# EAGLE design pi_3_hat_V3 (EAGLE 9.4.1)
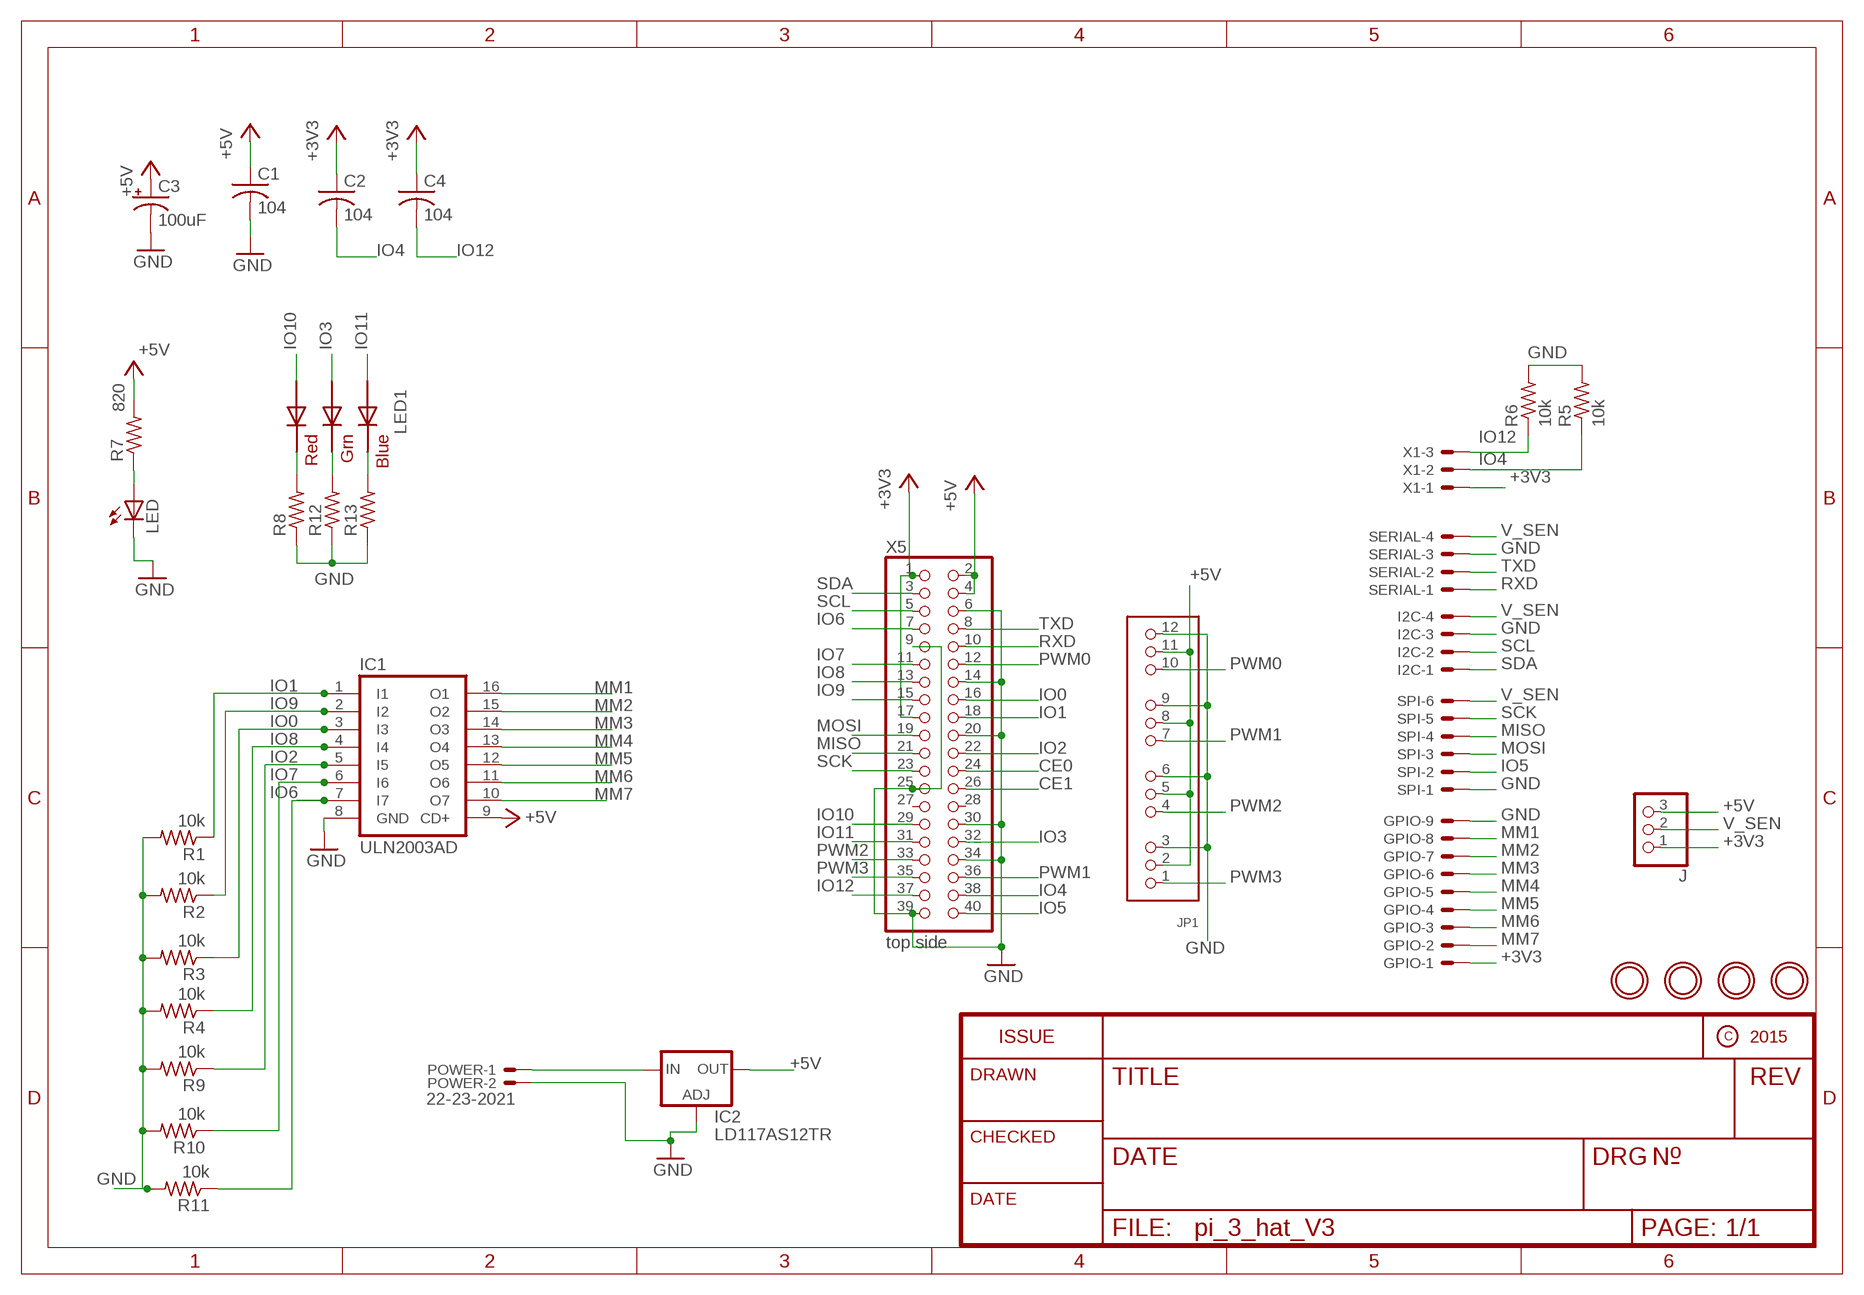
[diagram p0: schematic, sheet 1]

## Parts
C1  104  C-USC1206  [C1206]
C2  104  C-USC1206  [C1206]
C3  100uF  CPOL-USE2.5-6  [E2,5-6]
C4  104  C-USC1206  [C1206]
GPIO  22-23-2091  [22-23-2091]
I2C  22-23-2041  [22-23-2041]
IC1  ULN2003AD  [SO16]
IC2  LD117AS12TR  [SOT223]
J  PINHD-1X3  [1X03]
JP1  HEADER-3X04  [3X04]
LED  LEDSMT1206  [1206]
LED1  RGBLED5050  [RGBLED5050]
POWER  22-23-2021  [22-23-2021]
R1  10k  R-US_R1206  [R1206]
R2  10k  R-US_R1206  [R1206]
R3  10k  R-US_R1206  [R1206]
R4  10k  R-US_R1206  [R1206]
R5  10k  R-US_R1206  [R1206]
R6  10k  R-US_R1206  [R1206]
R7  820  R-US_R1206  [R1206]
R8  R-US_R1206  [R1206]
R9  10k  R-US_R1206  [R1206]
R10  10k  R-US_R1206  [R1206]
R11  10k  R-US_R1206  [R1206]
R12  R-US_R1206  [R1206]
R13  R-US_R1206  [R1206]
SERIAL  22-23-2041  [22-23-2041]
SPI  22-23-2061  [22-23-2061]
U$4  MOUNTINGHOLE2.5  [MOUNTINGHOLE_2.5_PLATED]
U$5  MOUNTINGHOLE2.5  [MOUNTINGHOLE_2.5_PLATED]
U$6  MOUNTINGHOLE2.5  [MOUNTINGHOLE_2.5_PLATED]
U$7  MOUNTINGHOLE2.5  [MOUNTINGHOLE_2.5_PLATED]
X1  22-23-2031  [22-23-2031]
X5  top side  PINHD-2X20  [2X20]

## Nets
+3V3: C2.1 C4.1 GPIO.1 J.1 X1.1 X5.1 X5.17
+5V: C1.1 C3.+ IC1.9(CD+) IC2.4(OUT) J.3 JP1.2 JP1.5 JP1.8 JP1.11 R7.2 X5.2 X5.4
CE0: X5.24
CE1: X5.26
GND: C1.2 C3.- GPIO.9 I2C.3 IC1.8(GND) IC2.1(ADJ) JP1.3 JP1.6 JP1.9 JP1.12 LED.C POWER.2 R1.2 R2.2 R3.2 R4.2 R5.2 R6.2 R8.1 R9.2 R10.2 R11.2 R12.1 R13.1 SERIAL.3 SPI.1 X5.6 X5.9 X5.14 X5.20 X5.25 X5.30 X5.34 X5.39
IO0: IC1.3(I3) R3.1 X5.16
IO1: IC1.1(I1) R1.1 X5.18
IO2: IC1.5(I5) R9.1 X5.22
IO3: LED1.1(GREEN_A) X5.32
IO4: C2.2 R5.1 X1.2 X5.38
IO5: SPI.2 X5.40
IO6: IC1.7(I7) R11.1 X5.7
IO7: IC1.6(I6) R10.1 X5.11
IO8: IC1.4(I4) R4.1 X5.13
IO9: IC1.2(I2) R2.1 X5.15
IO10: LED1.2(RED_A) X5.29
IO11: LED1.3(BLUE_A) X5.31
IO12: C4.2 R6.1 X1.3 X5.37
MISO: SPI.4 X5.21
MM1: GPIO.8 IC1.16(O1)
MM2: GPIO.7 IC1.15(O2)
MM3: GPIO.6 IC1.14(O3)
MM4: GPIO.5 IC1.13(O4)
MM5: GPIO.4 IC1.12(O5)
MM6: GPIO.3 IC1.11(O6)
MM7: GPIO.2 IC1.10(O7)
MOSI: SPI.3 X5.19
N$1: LED.A R7.1
N$3: LED1.5(RED_C) R8.2
N$4: IC2.3(IN) POWER.1
N$5: LED1.6(GREEN_C) R12.2
N$6: LED1.4(BLUE_C) R13.2
PWM0: JP1.10 X5.12
PWM1: JP1.7 X5.36
PWM2: JP1.4 X5.33
PWM3: JP1.1 X5.35
RXD: SERIAL.1 X5.10
SCK: SPI.5 X5.23
SCL: I2C.2 X5.5
SDA: I2C.1 X5.3
TXD: SERIAL.2 X5.8
V_SEN: I2C.4 J.2 SERIAL.4 SPI.6
Unconnected: X5.27 X5.28

## Library data of the parts
C1 C2 C4 = rcl:C-US: CAPACITOR, American symbol; SPICEPREFIX: C
C3 = adafruit:CPOL-US: POLARIZED CAPACITOR, American symbol
GPIO = con-molex:22-23-2091: .100" (2.54mm) Center Header - 9 Pin; MF: MOLEX; MPN: 22-23-2091; OC_FARNELL: 1756827; OC_NEWARK: 56H0450
I2C SERIAL = con-molex:22-23-2041: .100" (2.54mm) Center Header - 4 Pin; MF: MOLEX; MPN: 22-23-2041; OC_FARNELL: 1462920; OC_NEWARK: 38C0355
IC1 = uln-udn:ULN2003A: DRIVER ARRAY
IC2 = v-reg:LD117A?*: Low drop fixed and adjustable positive voltage regulators 1 A Source: http://www.st.com/stonline/products/literature/ds/7194/ld1117axx.pdf
J = pinhead:PINHD-1X3: PIN HEADER
JP1 = microbuilder:HEADER-3X04
LED = adafruit:LED: LED OSRAM: - CHIPLED LG R971, LG N971, LY N971, LG Q971, LY Q971, LO R971, LY R971 LH N974, LH R974 LS Q976, LO Q976, LY Q976 LO Q996 - Hyper CHIPLED LW Q18S LB Q993, LB Q99A, LB R99A - SideLED LS A670, LO A670, LY A670, LG A670, LP A670 LB A673, LV A673, LT A673, LW A673 LH A674 LY A675 LS A676, LA A676, LO A676, LY A676, LW A676 LS A679, LY A679, LG A679 - Hyper Micro SIDELED® LS Y876, LA Y876, LO Y876, LY Y876 LT Y87S - SmartLED LW L88C, LW L88S LB L89C, LB L89S, LG L890 LS L89K, LO L89K, LY L89K LS L896, LA L896, LO L896, LY L896 - TOPLED LS T670, LO T670, LY T670, LG T670, LP T670 LSG T670, LSP T670, LSY T670, LOP T670, LYG T670 LG T671, LOG T671, LSG T671 LB T673, LV T673, LT T673, LW T673 LH T674 LS T676, LA T676, LO T676, LY T676, LB T676, LH T676, LSB T676, LW T676 LB T67C, LV T67C, LT T67C, LS T67K, LO T67K, LY T67K, LW E67C LS E67B, LA E67B, LO E67B, LY E67B, LB E67C, LV E67C, LT E67C LW T67C LS T679, LY T679, LG T679 LS T770, LO T770, LY T770, LG T770, LP T770 LB T773, LV T773, LT T773, LW T773 LH T774 LS E675, LA E675, LY E675, LS T675 LS T776, LA T776, LO T776, LY T776, LB T776 LHGB T686 LT T68C, LB T68C - Hyper Mini TOPLED® LB M676 - Mini TOPLED Santana® LG M470 LS M47K, LO M47K, LY M47K Source: http://www.osram.convergy.de/
LED1 = adafruit:RGBLED: For 5050 RGB LEDs, the order of the LEDs may vary from one manufacturer to another!
POWER = con-molex:22-23-2021: .100" (2.54mm) Center Header - 2 Pin; MF: MOLEX; MPN: 22-23-2021; OC_FARNELL: 1462926; OC_NEWARK: 25C3832
R1-R13 = rcl:R-US_: RESISTOR, American symbol; SPICEPREFIX: R
SPI = con-molex:22-23-2061: .100" (2.54mm) Center Header - 6 Pin; MF: MOLEX; MPN: 22-23-2061; OC_FARNELL: 1462922; OC_NEWARK: 27C1933
U$4-U$7 = microbuilder:MOUNTINGHOLE: Mounting Hole For #2 screws (0.086"/2.18mm width, 0.094"/2.4mm hole) use 2.5mm; BOM: EXCLUDE
X1 = con-molex:22-23-2031: .100" (2.54mm) Center Header - 3 Pin; MF: MOLEX; MPN: 22-23-2031; OC_FARNELL: 1462950; OC_NEWARK: 30C0862
X5 = pinhead:PINHD-2X20: PIN HEADER

## Board
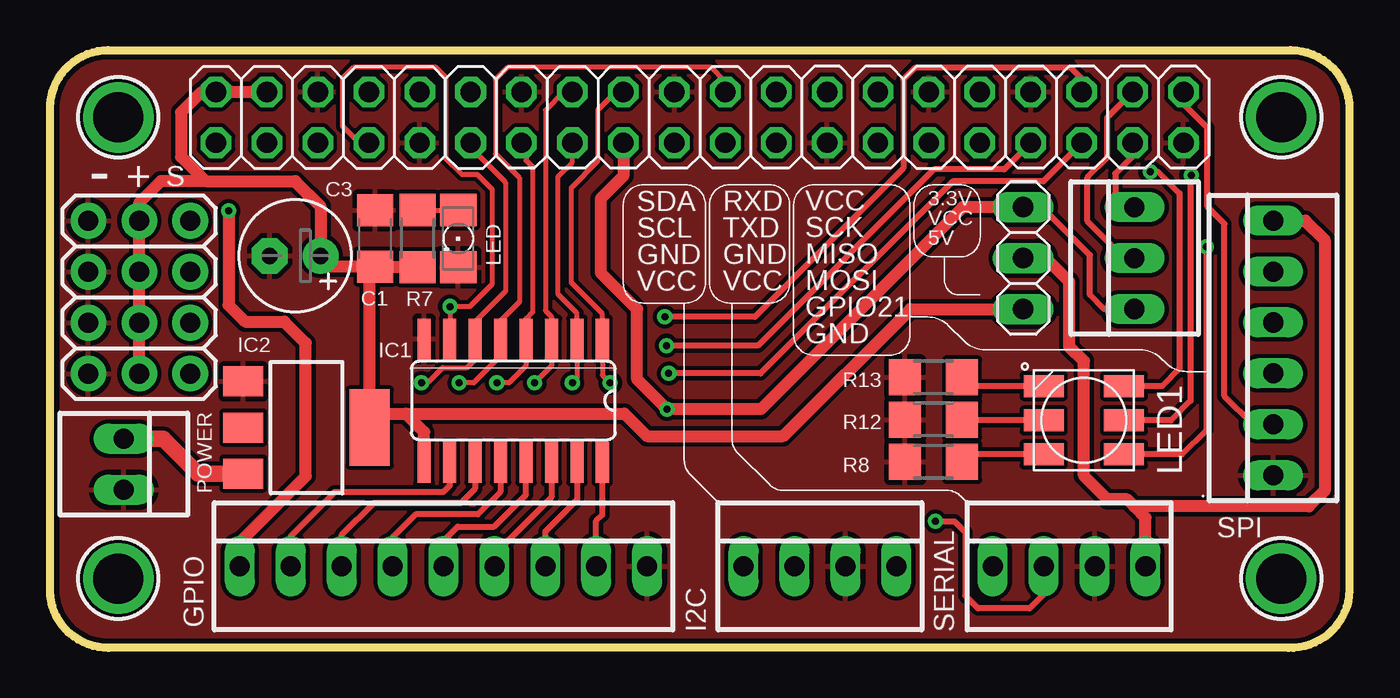
[diagram p1: board, top side]
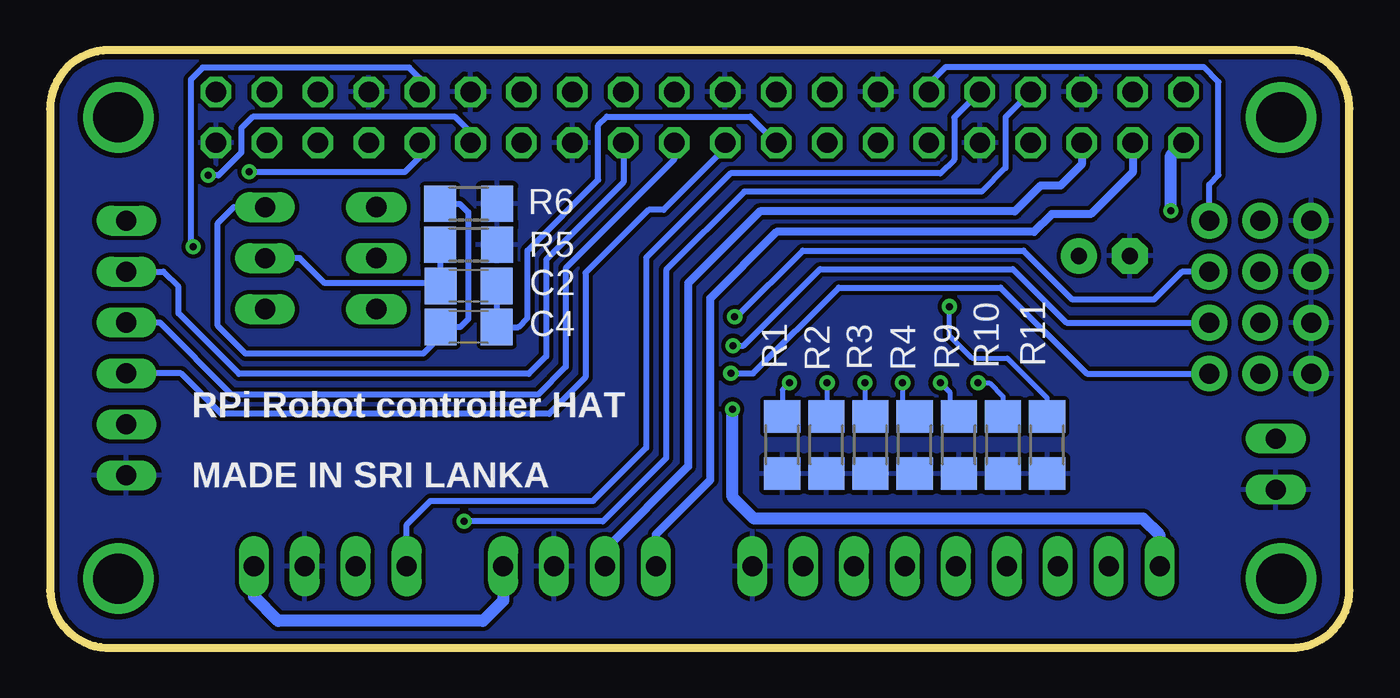
[diagram p2: board, bottom side, seen from below]

Size 64.8 x 29.8 mm. Coordinates in mm from the lower left corner, seen from the top.
Outline: 0,2.87 0,26.89 arc-90 2.9,29.8 61.87,29.8 arc-90 64.8,26.87 64.8,2.86 arc-90 61.75,0 2.92,0 arc-90 0,2.87
Copper layers (1*16): Top 0.035mm / dielectric 1.5mm / Bottom 0.035mm
Design rules "Enclosure-NewZealand V4 *": minimum track width 10mil, minimum drill 10mil, track to track 0.205mm, track to pad 0.205mm, pad to pad 0.205mm, via to via 0.205mm, smd to smd 8mil, copper to edge 10mil, drill to drill 20mil, minimum pad ring 10mil, minimum via ring 8mil, stop-mask expansion 0.0516mm, vias tented up to drill 0mil, thermal gap 10mil

### Footprints (pad centres in the part's own frame; a part is rotated, then mirrored left to right if it is on the bottom)
C1206 = smd 1.6 x 1.8: 1 -1.4,0; 2 1.4,0
E2,5-6 = drill 0.813 pad 1.778: + -1.27,0 | drill 0.813 pad 1.778 octagon: - 1.27,0
22-23-2091 = drill 1 long: 1 -10.16,0; 2 -7.62,0; 3 -5.08,0; 4 -2.54,0; 5 0,0; 6 2.54,0; 7 5.08,0; 8 7.62,0; 9 10.16,0
22-23-2041 = drill 1 long: 1 -3.81,0; 2 -1.27,0; 3 1.27,0; 4 3.81,0
SO16 = smd 0.66 x 2.032: 1 -4.445,-3.073; 2 -3.175,-3.073; 3 -1.905,-3.073; 4 -0.635,-3.073; 5 0.635,-3.073; 6 1.905,-3.073; 7 3.175,-3.073; 8 4.445,-3.073; 9 4.445,3.073; 10 3.175,3.073; 11 1.905,3.073; 12 0.635,3.073; 13 -0.635,3.073; 14 -1.905,3.073; 15 -3.175,3.073; 16 -4.445,3.073
SOT223 = smd 1.5 x 2: 1 -2.3,-3.15; 2 0,-3.15; 3 2.3,-3.15 | smd 3.8 x 2: 4 0,3.15
1X03 = drill 1.016 long: 1 -2.54,0; 2 0,0; 3 2.54,0
3X04 = drill 1 pad 1.778: 1 -3.81,-2.54; 2 -3.81,0; 3 -3.81,2.54; 4 -1.27,-2.54; 5 -1.27,0; 6 -1.27,2.54; 7 1.27,-2.54; 8 1.27,0; 9 1.27,2.54; 10 3.81,-2.54; 11 3.81,0; 12 3.81,2.54
1206 = smd 1.6 x 1.803: A -1.422,0; C 1.422,0
RGBLED5050 = smd 2 x 1.1: 1 -2,1.7; 2 -2,0; 3 -2,-1.7; 4 2,-1.7; 5 2,0; 6 2,1.7
22-23-2021 = drill 1 long: 1 -1.27,0; 2 1.27,0
R1206 = smd 1.6 x 1.803: 1 -1.422,0; 2 1.422,0
22-23-2061 = drill 1 long: 1 -6.35,0; 2 -3.81,0; 3 -1.27,0; 4 1.27,0; 5 3.81,0; 6 6.35,0
MOUNTINGHOLE_2.5_PLATED = drill 2.5 pad 3.2: P$1 0,0
22-23-2031 = drill 1 long: 1 -2.54,0; 2 0,0; 3 2.54,0
2X20 = drill 1.016 octagon: 1 -24.13,-1.27; 2 -24.13,1.27; 3 -21.59,-1.27; 4 -21.59,1.27; 5 -19.05,-1.27; 6 -19.05,1.27; 7 -16.51,-1.27; 8 -16.51,1.27; 9 -13.97,-1.27; 10 -13.97,1.27; 11 -11.43,-1.27; 12 -11.43,1.27; 13 -8.89,-1.27; 14 -8.89,1.27; 15 -6.35,-1.27; 16 -6.35,1.27; 17 -3.81,-1.27; 18 -3.81,1.27; 19 -1.27,-1.27; 20 -1.27,1.27; 21 1.27,-1.27; 22 1.27,1.27; 23 3.81,-1.27; 24 3.81,1.27; 25 6.35,-1.27; 26 6.35,1.27; 27 8.89,-1.27; 28 8.89,1.27; 29 11.43,-1.27; 30 11.43,1.27; 31 13.97,-1.27; 32 13.97,1.27; 33 16.51,-1.27; 34 16.51,1.27; 35 19.05,-1.27; 36 19.05,1.27; 37 21.59,-1.27; 38 21.59,1.27; 39 24.13,-1.27; 40 24.13,1.27

### Placement (x,y rotation side)
C1  16.22,20.41 90 top
C2  43.93,18.04 180 bottom
C3  12.22,19.54 180 top
C4  43.93,16 180 bottom
GPIO  19.62,4.07 0 top
I2C  38.4,4.07 0 top
IC1  23.1,12.33 180 top
IC2  12.79,10.98 270 top
J  48.54,19.43 270 top
JP1  4.45,17.48 90 top
LED  20.36,20.41 270 top
LED1  51.56,11.34 180 top
POWER  3.68,9.16 270 top
R1  28.29,10.11 270 bottom
R2  26.08,10.11 270 bottom
R3  23.88,10.11 270 bottom
R4  21.68,10.11 270 bottom
R5  43.93,20.09 0 bottom
R6  43.93,22.14 0 bottom
R7  18.33,20.41 270 top
R8  44.06,11.38 0 top
R9  19.48,10.11 270 bottom
R10  17.28,10.11 270 bottom
R11  15.07,10.11 270 bottom
R12  44.06,9.27 0 top
R13  44.06,13.48 0 top
SERIAL  50.83,4.07 0 top
SPI  61,14.95 90 top
U$4  61.4,3.45 0 top
U$5  61.4,26.45 0 top
U$6  3.4,26.45 0 top
U$7  3.4,3.45 0 top
X1  54.09,19.43 90 top
X5  32.4,26.45 0 top

### Tracks (layer width: path | path; a pad name or v marks a point on that pad's centre or on a via)
+3V3  (via drill 0.35)
  Top 0.305: X1.1 52.56,16.89 51.86,17.6 51.86,19.58 49.47,21.97 J.1
  Top 0.61: X5.17 28.59,23.53 27.45,22.39 27.45,18.71 29.27,16.88 29.27,13.39 v30.77,11.9 35.45,11.9 45.52,21.97 J.1 | v8.9,21.79 8.9,17.09 9.73,16.26 11.68,16.26 12.75,15.19 12.75,8.56 9.46,5.26 GPIO.1
  Bottom 0.305: X5.17 29.89,26.48 37.03,26.48 37.46,26.05 37.46,23.33 40.99,19.8 40.99,16.45 41.45,16 C4.1 C2.1
  Bottom 0.61: v8.9,21.79 8.9,24.55 X5.1 | GPIO.1 9.46,5.61 10.3,6.44 29.69,6.44 30.77,7.52 v30.77,11.9
+5V
  Top 0.61: 15.94,11.77 IC2.4 | X5.4 X5.2 7.57,27.72 6.53,26.69 6.53,24.48 7.75,23.27 | 7.75,23.27 | 7.75,23.27 12.23,23.27 13.49,22.01 C3.+ 14.03,19.01 C1.1 16.24,18.99 | JP1.2 JP1.5 JP1.8 JP1.11 4.45,22.19 5.53,23.27 7.75,23.27 | 17.73,11.68 16.03,11.68 15.94,11.77 | IC1.9 18.65,10.76 17.73,11.68 | R7.2 16.24,18.99 | 16.24,18.99 15.94,18.68 15.94,11.77 | 17.73,11.68 28.64,11.68 29.76,10.56 36.56,10.56 42.9,16.89 J.3
GND
  pour Top: 66.45,-1.34 66.45,2.65 66.45,31.34 -0.68,31.34 -0.68,-1.34 -0.66,-1.34 -0.66,-1.33
  pour Bottom: -0.76,-1.49 66.64,-1.49 66.64,31.49 -0.76,31.49
IO0  (via drill 0.35)
  Top 0.254: X5.16 25.61,27.72 24.7,26.81 24.7,16.82 25,16.51 IC1.3 25,14.05 v24.17,13.21
  Bottom 0.254: v24.17,13.21 24.17,11.82 R3.1
IO1  (via drill 0.35)
  Top 0.254: X5.18 28.23,27.72 27.31,26.8 27.31,24.26 26,22.95 26,18.2 27.54,16.65 IC1.1 27.54,13.6 v27.93,13.21
  Bottom 0.254: v27.93,13.21 28.29,12.86 R1.1
IO2  (via drill 0.35)
  Top 0.254: X5.22 33.67,28.26 32.98,28.94 22.82,28.94 22.22,28.34 22.22,24.63 23.41,23.43 23.41,17.25 22.46,16.31 IC1.5 22.46,14.56 21.12,13.21 v20.4,13.21
  Bottom 0.254: v20.4,13.21 19.93,12.75 19.93,11.89 19.57,11.53 R9.1
IO3  (via drill 0.35)
  Top 0.305: v57.66,20 57.66,10.86 56.45,9.64 LED1.1
  Bottom 0.305: X5.32 46.37,28.4 46.89,28.92 57.2,28.92 57.79,28.33 57.79,20.12 v57.66,20
IO4
  Top 0.305: X1.2 53.58,19.43 51.74,21.27 51.74,23.46 52.72,24.44 52.72,26.45 X5.38
  Bottom 0.305: R5.1 45.35,18.06 C2.2 45.48,18.19 51.1,18.19 52.34,19.43 X1.2
IO5
  Top 0.305: SPI.2 59.98,11.14 58.57,12.55 58.57,21.14 57.72,22 57.72,25.94 56.53,27.12 X5.40
IO6  (via drill 0.35)
  Top 0.254: IC1.7 19.94,15.42 v19.94,17.02 20.93,17.02 22.03,18.12 22.03,22.87 21.3,23.6 20.54,23.6 19.72,24.42 19.72,28.46 19.21,28.97 15.16,28.97 14.59,28.39 14.59,26.01 15.41,25.18 X5.7
  Bottom 0.254: R11.1 15.07,12.45 17.06,14.44 18.82,14.44 19.94,15.56 v19.94,17.02
IO7  (via drill 0.35)
  Top 0.254: v18.52,13.21 18.83,13.21 19.58,13.97 20.81,13.97 21.19,14.36 IC1.6 21.19,16.25 21.33,16.39 22.71,17.77 22.71,23.21 20.97,24.95 X5.11
  Bottom 0.254: v18.52,13.21 17.96,13.21 17.28,12.53 R10.1
IO8  (via drill 0.35)
  Top 0.254: v22.28,13.21 22.88,13.21 23.73,14.06 IC1.4 23.73,16.42 24.07,16.75 24.07,23.98 23.73,24.31 23.73,24.96 X5.13
  Bottom 0.254: v22.28,13.21 22.28,12.14 R4.1
IO9  (via drill 0.35)
  Top 0.254: v26.05,13.21 26.27,13.44 IC1.2 26.27,16.69 25.34,17.62 25.34,23.51 26.05,24.22 X5.15
  Bottom 0.254: v26.05,13.21 26.05,11.57 R2.1
IO10  (via drill 0.35)
  Top 0.305: LED1.2 55.91,11.34 56.87,12.31 56.87,23.52 v56.91,23.56
  Bottom 0.305: X5.29 43.83,25.71 44.6,26.47 54.7,26.47 55.26,25.91 55.26,24.7 56.4,23.56 v56.91,23.56
IO11  (via drill 0.35)
  Top 0.305: LED1.3 55.47,13.04 56.33,13.91 56.33,22.67 55.27,23.74 v54.87,23.74
  Bottom 0.305: X5.31 46.37,24.47 47.1,23.74 v54.87,23.74
IO12
  Top 0.305: X5.37 53.99,24.5 53.13,23.64 53.13,22.65 53.8,21.97 X1.3
  Bottom 0.305: X1.3 55.64,21.97 56.43,21.18 56.43,16.05 55.06,14.67 46.2,14.67 45.33,15.54 C4.2 44.35,15.99 43.95,16.39 43.95,21.72 44.37,22.14 R6.1
MISO
  Bottom 0.305: SPI.4 59.33,16.22 55.74,12.63 40.47,12.63 39.09,14 39.09,18.93 33.67,24.35 X5.21
MM1
  Top 0.305: IC1.16 27.54,6.63 27.24,6.33 GPIO.8
MM2
  Top 0.305: IC1.15 26.27,7.38 24.7,5.81 GPIO.7
MM3
  Top 0.305: GPIO.6 22.16,4.67 25,7.51 IC1.14
MM4
  Top 0.305: IC1.13 23.73,7.64 22.14,6.05 20.33,6.05 19.62,5.33 GPIO.5
MM5
  Top 0.305: IC1.12 22.46,7.79 21.33,6.66 18.23,6.66 17.08,5.51 GPIO.4
MM6
  Top 0.305: IC1.11 21.19,7.93 20.48,7.22 16.12,7.22 14.54,5.63 GPIO.3
MM7
  Top 0.305: IC1.10 19.92,8.08 19.6,7.76 14.19,7.76 12,5.57 GPIO.2
MOSI
  Bottom 0.305: SPI.3 58.28,13.68 56.26,11.66 39.92,11.66 38.1,13.48 38.1,18.69 34.95,21.83 34.2,21.83 31.13,24.91 X5.19
N$1
  Top 0.254: R7.1 LED.A
N$3
  Top 0.305: LED1.5 45.51,11.34 R8.2
N$4
  Top 0.813: POWER.1 5.64,10.43 7.39,8.68 IC2.3
N$5
  Top 0.305: LED1.6 45.85,9.64 R12.2
N$6
  Top 0.305: LED1.4 45.92,13.04 R13.2
PWM0
  Bottom 0.305: JP1.10 6.99,23.11 6.53,23.58 6.53,28.21 7.28,28.96 20.13,28.96 20.97,28.13 X5.12
PWM1  (via drill 0.35)
  Top 0.305: v30.66,16.51 35.15,16.51 42.56,23.91 42.56,28.34 43.13,28.91 50.9,28.91 51.45,28.37 X5.36
  Bottom 0.305: JP1.7 8.35,18.75 9.75,17.36 13.81,17.36 16.26,19.8 27.26,19.8 30.56,16.51 v30.66,16.51
PWM2  (via drill 0.35)
  Top 0.305: X5.33 47.58,23.85 44.08,23.85 35.29,15.07 v30.74,15.07
  Bottom 0.305: JP1.4 14.11,16.21 16.79,18.88 26.4,18.88 30.22,15.07 v30.74,15.07
PWM3  (via drill 0.35)
  Top 0.305: X5.35 49.53,23.26 45.01,23.26 35.44,13.68 v30.85,13.68
  Bottom 0.305: JP1.1 13.1,13.67 17.4,17.96 25.46,17.96 29.74,13.68 v30.85,13.68
RXD
  Bottom 0.305: X5.10 19.71,26.44 19.71,24.34 20.4,23.65 30.88,23.65 35.08,19.45 35.08,9.97 37.71,7.33 45.83,7.33 47.02,6.14 SERIAL.1
SCK
  Bottom 0.305: X5.23 36.21,23.21 40.06,19.36 40.06,14.53 40.93,13.66 55.38,13.66 58.39,16.67 58.39,17.99 59.16,18.76 SPI.5
SCL
  Bottom 0.406: X5.5 13.35,24.1 14.41,23.04 15.41,23.04 16.68,21.77 29.4,21.77 32.98,18.18 32.98,9.04 37.13,4.9 I2C.2
SDA
  Bottom 0.406: X5.3 10.81,23.71 12.9,21.62 14.85,21.62 15.73,20.74 28.57,20.74 31.87,17.44 31.87,8.38 34.59,5.66 I2C.1
TXD  (via drill 0.35)
  Top 0.305: SERIAL.2 49.56,2.67 48.86,1.97 46.27,1.97 45.65,2.6 45.65,5.76 45.1,6.31 v44.15,6.31
  Bottom 0.305: X5.8 17.15,26.46 17.15,23.93 18.33,22.75 30.17,22.75 34.08,18.85 34.08,9.46 37.23,6.31 v44.15,6.31
V_SEN
  Top 0.61: SPI.6 62.61,21.3 63.56,20.35 63.56,7.83 62.79,7.05 54.07,7.05 | J.2 49.66,19.43 50.83,18.26 50.83,15 51.52,14.31 51.56,14.31 51.56,8.58 52.74,7.4 53.72,7.4 54.07,7.05 | SERIAL.4 54.64,6.49 54.42,6.7 54.07,7.05
  Bottom 0.61: I2C.4 42.21,2.35 43.21,1.35 53.42,1.35 54.64,2.56 SERIAL.4

### Text on the board
tPlace: SDA | RXD | VCC | 3.3V | SCL | TXD | SCK | VCC | 5V | GND | GND | MISO | VCC | VCC | MOSI | GPIO21 | GND
tNames: - | + | S
bNames: RPi Robot controller HAT | MADE IN SRI LANKA